# EAGLE design snc98_3x4_Switch-futuba (EAGLE 6.6.0)
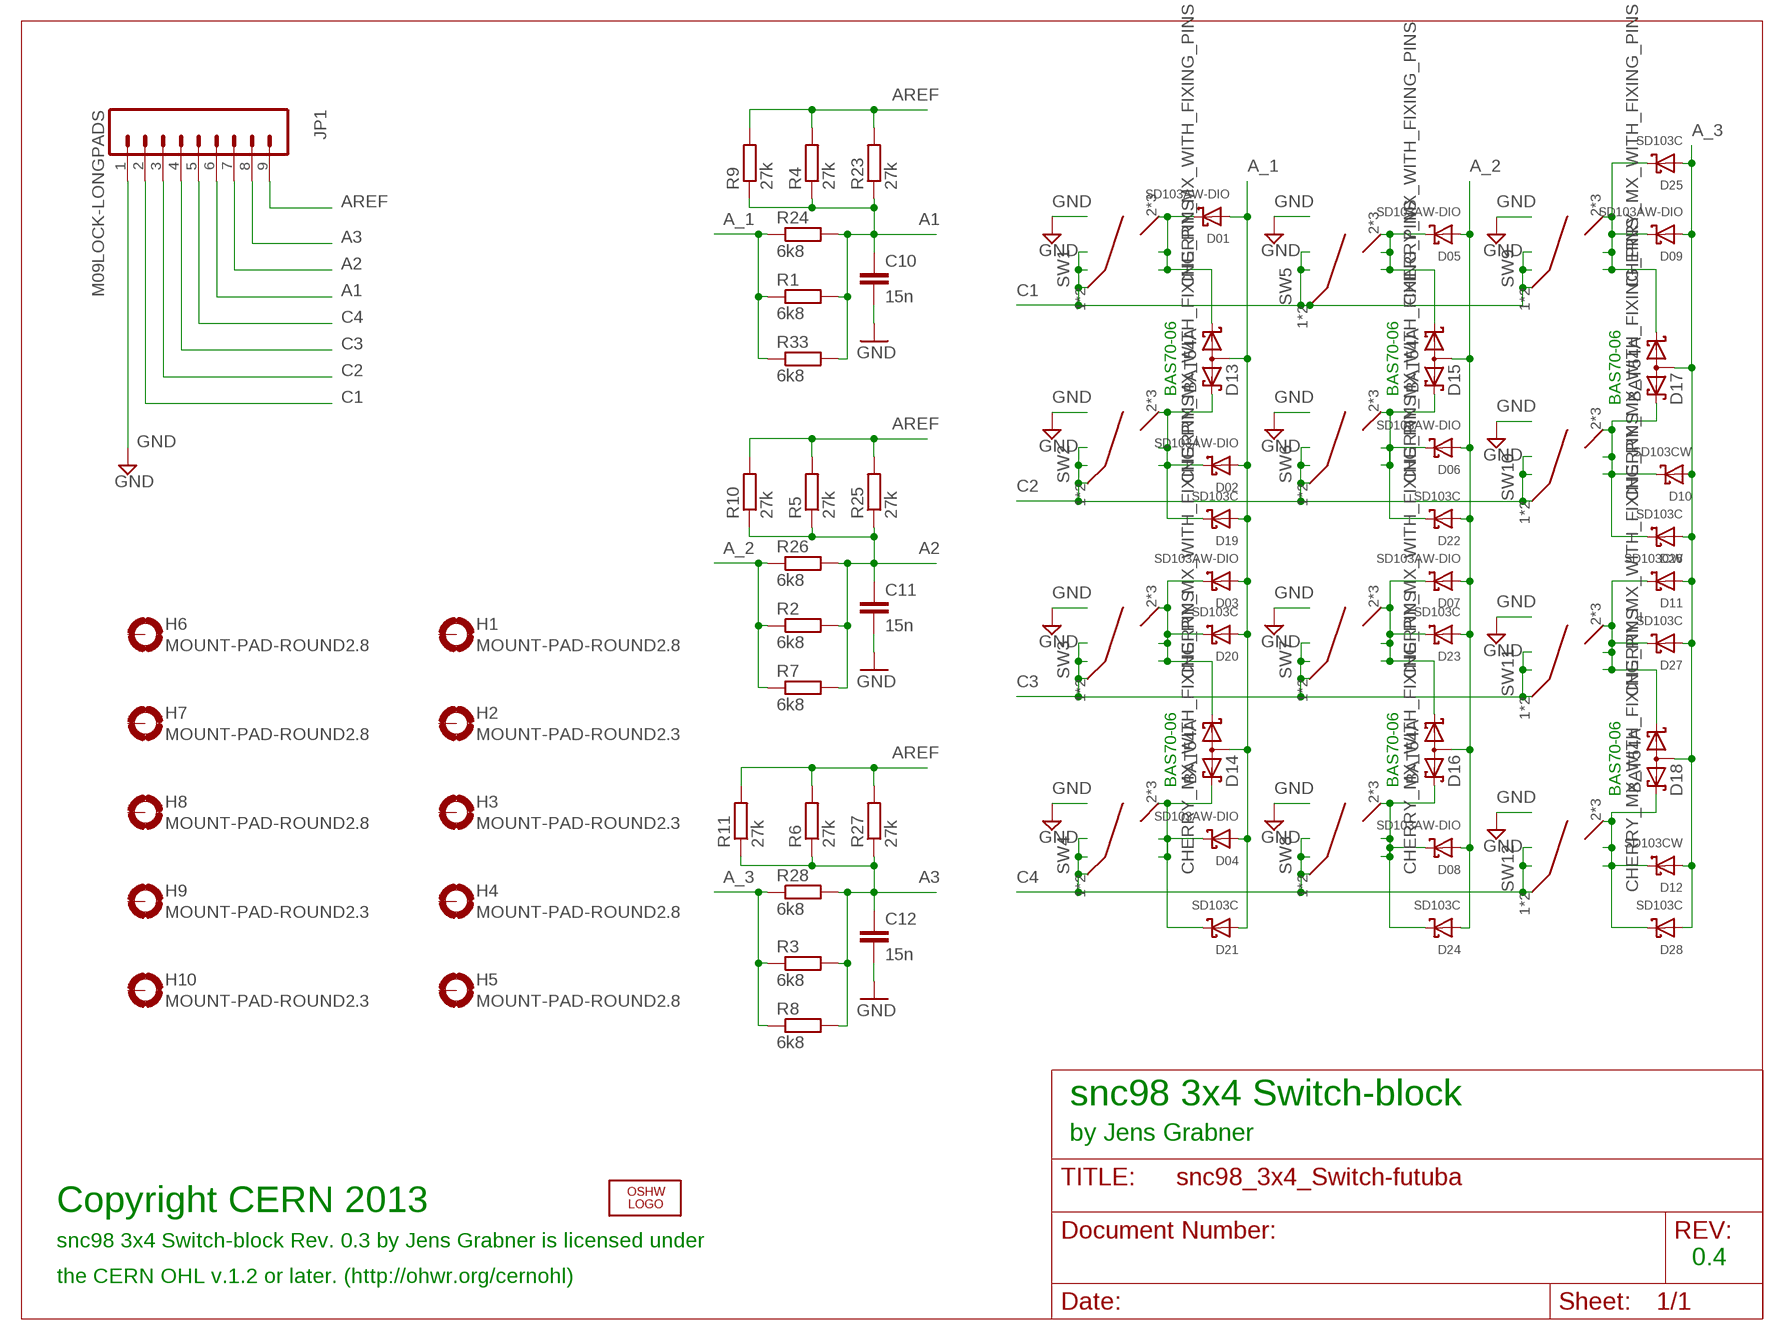
[diagram p0: schematic, sheet 1]

## Parts
C10  15n  C-EUC1206K  [C1206K]
C11  15n  C-EUC1206K  [C1206K]
C12  15n  C-EUC1206K  [C1206K]
D01  SD103AW-DIO  DIODESOD-123F  [SOD-123F]
D02  SD103AW-DIO  DIODESOD-123F  [SOD-123F]
D03  SD103AW-DIO  DIODESOD-123F  [SOD-123F]
D04  SD103AW-DIO  DIODESOD-123F  [SOD-123F]
D05  SD103AW-DIO  DIODESOD-123F  [SOD-123F]
D06  SD103AW-DIO  DIODESOD-123F  [SOD-123F]
D07  SD103AW-DIO  DIODESOD-123F  [SOD-123F]
D08  SD103AW-DIO  DIODESOD-123F  [SOD-123F]
D09  SD103AW-DIO  DIODESOD-123F  [SOD-123F]
D10  SD103CW  DIODESOD-123F  [SOD-123F]
D11  SD103CW  DIODESOD-123F  [SOD-123F]
D12  SD103CW  DIODESOD-123F  [SOD-123F]
D13  BAT54A  [SOT23]
D14  BAT54A  [SOT23]
D15  BAT54A  [SOT23]
D16  BAT54A  [SOT23]
D17  BAT54A  [SOT23]
D18  BAT54A  [SOT23]
D19  SD103C  DIODE280MIL-TH  [280MIL-TH]
D20  SD103C  DIODE280MIL-TH  [280MIL-TH]
D21  SD103C  DIODE280MIL-TH  [280MIL-TH]
D22  SD103C  DIODE280MIL-TH  [280MIL-TH]
D23  SD103C  DIODE280MIL-TH  [280MIL-TH]
D24  SD103C  DIODE280MIL-TH  [280MIL-TH]
D25  SD103C  DIODE280MIL-TH  [280MIL-TH]
D26  SD103C  DIODE280MIL-TH  [280MIL-TH]
D27  SD103C  DIODE280MIL-TH  [280MIL-TH]
D28  SD103C  DIODE280MIL-TH  [280MIL-TH]
H1  MOUNT-PAD-ROUND2.8  [2,8-PAD]
H2  MOUNT-PAD-ROUND2.3  [2,3-PAD]
H3  MOUNT-PAD-ROUND2.3  [2,3-PAD]
H4  MOUNT-PAD-ROUND2.8  [2,8-PAD]
H5  MOUNT-PAD-ROUND2.8  [2,8-PAD]
H6  MOUNT-PAD-ROUND2.8  [2,8-PAD]
H7  MOUNT-PAD-ROUND2.8  [2,8-PAD]
H8  MOUNT-PAD-ROUND2.8  [2,8-PAD]
H9  MOUNT-PAD-ROUND2.3  [2,3-PAD]
H10  MOUNT-PAD-ROUND2.3  [2,3-PAD]
JP1  M09LOCK-LONGPADS  [1X09_LOCK_LONGPADS]
LOGO1  OSHW_LOGO_8MILX0150-NT  [OSHW_8X150_NOTEXT]
R1  6k8  R-EU_R1206  [R1206]
R2  6k8  R-EU_R1206  [R1206]
R3  6k8  R-EU_R1206  [R1206]
R4  27k  R-EU_R1206  [R1206]
R5  27k  R-EU_R1206  [R1206]
R6  27k  R-EU_R1206  [R1206]
R7  6k8  R-EU_M0805  [M0805]
R8  6k8  R-EU_M0805  [M0805]
R9  27k  R-EU_M0805  [M0805]
R10  27k  R-EU_M0805  [M0805]
R11  27k  R-EU_M0805  [M0805]
R23  27k  R-EU_0204/5  [0204/5]
R24  6k8  R-EU_0204/5  [0204/5]
R25  27k  R-EU_0204/5  [0204/5]
R26  6k8  R-EU_0204/5  [0204/5]
R27  27k  R-EU_0204/5  [0204/5]
R28  6k8  R-EU_0204/5  [0204/5]
R33  6k8  R-EU_M0805  [M0805]
SW1  CHERRY_MX_WITH_FIXING_PINS  [MX1A-XXNW]
SW2  CHERRY_MX_WITH_FIXING_PINS  [MX1A-XXNW]
SW3  CHERRY_MX_WITH_FIXING_PINS  [MX1A-XXNW]
SW4  CHERRY_MX_WITH_FIXING_PINS  [MX1A-XXNW]
SW5  CHERRY_MX_WITH_FIXING_PINS  [MX1A-XXNW]
SW6  CHERRY_MX_WITH_FIXING_PINS  [MX1A-XXNW]
SW7  CHERRY_MX_WITH_FIXING_PINS  [MX1A-XXNW]
SW8  CHERRY_MX_WITH_FIXING_PINS  [MX1A-XXNW]
SW9  CHERRY_MX_WITH_FIXING_PINS  [MX1A-XXNW]
SW10  CHERRY_MX_WITH_FIXING_PINS  [MX1A-XXNW]
SW11  CHERRY_MX_WITH_FIXING_PINS  [MX1A-XXNW]
SW12  CHERRY_MX_WITH_FIXING_PINS  [MX1A-XXNW]

## Nets
A1: C10.1 JP1.6 R1.2 R4.1 R9.1 R23.1 R24.2 R33.2
A2: C11.1 JP1.7 R2.2 R5.1 R7.2 R10.1 R25.1 R26.2
A3: C12.1 JP1.8 R3.2 R6.1 R8.2 R11.1 R27.1 R28.2
A_1: D01.A D02.A D03.A D04.A D13.3(AA) D14.3(AA) D19.P$1(A) D20.P$1(A) D21.P$1(A) R1.1 R24.1 R33.1
A_2: D05.A D06.A D07.A D08.A D15.3(AA) D16.3(AA) D22.P$1(A) D23.P$1(A) D24.P$1(A) R2.1 R7.1 R26.1
A_3: D09.A D10.A D11.A D12.A D17.3(AA) D18.3(AA) D25.P$1(A) D26.P$1(A) D27.P$1(A) D28.P$1(A) R3.1 R8.1 R28.1
AREF: JP1.9 R4.2 R5.2 R6.2 R9.2 R10.2 R11.2 R23.2 R25.2 R27.2
C1: JP1.2 SW1.1 SW1.3 SW5.1 SW5.3 SW9.1 SW9.3
C2: JP1.3 SW2.1 SW2.3 SW6.1 SW6.3 SW10.1 SW10.3
C3: JP1.4 SW3.1 SW3.3 SW7.1 SW7.3 SW11.1 SW11.3
C4: JP1.5 SW4.1 SW4.3 SW8.1 SW8.3 SW12.1 SW12.3
GND: C10.2 C11.2 C12.2 JP1.1
N$2: D04.C D14.2(K2) D21.P$2(C) SW4.2 SW4.4 SW4.5
N$6: D01.C D13.1(K1) SW1.2 SW1.4 SW1.5
N$16: D09.C D17.1(K1) D25.P$2(C) SW9.2 SW9.4 SW9.5
N$18: D10.C D17.2(K2) D26.P$2(C) SW10.2 SW10.4 SW10.5
N$19: D02.C D13.2(K2) D19.P$2(C) SW2.2 SW2.4 SW2.5
N$21: D11.C D18.1(K1) D27.P$2(C) SW11.2 SW11.4 SW11.5
N$22: D12.C D18.2(K2) D28.P$2(C) SW12.2 SW12.4 SW12.5
N$24: D05.C D15.1(K1) SW5.2 SW5.4 SW5.5
N$25: D06.C D15.2(K2) D22.P$2(C) SW6.2 SW6.4 SW6.5
N$28: D07.C D16.1(K1) D23.P$2(C) SW7.2 SW7.4 SW7.5
N$30: D08.C D16.2(K2) D24.P$2(C) SW8.2 SW8.4 SW8.5
N$32: D03.C D14.1(K1) D20.P$2(C) SW3.2 SW3.4 SW3.5
Unconnected: H1.B2,8(MOUNT) H2.B2,8(MOUNT) H3.B2,8(MOUNT) H4.B2,8(MOUNT) H5.B2,8(MOUNT) H6.B2,8(MOUNT) H7.B2,8(MOUNT) H8.B2,8(MOUNT) H9.B2,8(MOUNT) H10.B2,8(MOUNT)

## Notes on the sheet
- BAS70-06 | BAS70-06
- BAS70-06
- BAS70-06 | BAS70-06
- BAS70-06
- snc98 3x4 Switch-block
- by Jens Grabner
- Copyright CERN 2013
- snc98 3x4 Switch-block Rev. 0.3 by Jens Grabner is licensed under
- 0.4
- the CERN OHL v.1.2 or later. (http://ohwr.org/cernohl)

## Library data of the parts
C10-C12 = rcl:C-EU: CAPACITOR, European symbol; OC_FARNELL: unknown; TME_EU: CC0805KRX7R9153
D01-D09 D10-D12 D19-D28 = BaseApp:DIODE; MF: MULTICOMP; MPN: SD103CW-7-F; OC_FARNELL: 2306221
D13-D18 = diode:BAT54A: Schottky Diodes Source: Fairchild .. BAT54.pdf; OC_FARNELL: unknown; TME_EU: BAT54A-DIO
H1-H10 = holes:MOUNT-PAD-ROUND: MOUNTING PAD, round; OC_FARNELL: unknown
JP1 = SparkFun-Connectors:M09: Header 9 Standard 9-pin 0.1" header. Use with straight break away headers (SKU : PRT-00116), right angle break away headers (PRT-00553), swiss pins (PRT-00743), machine pins (PRT-00117), and female headers (PRT-00115).; OC_FARNELL: unknown
LOGO1 = ohw-logo:OSHW_LOGO_8MIL; OC_FARNELL: unknown
R1-R6 R23-R28 = rcl:R-EU_: RESISTOR, European symbol; OC_FARNELL: unknown
R7 R8 R33 = rcl:R-EU_: RESISTOR, European symbol; OC_FARNELL: unknown; TME_EU: RC0805FR-076K8
R9-R11 = rcl:R-EU_: RESISTOR, European symbol; OC_FARNELL: unknown; TME_EU: RC0805FR-0727K
SW1-SW12 = Cherry_MX_v7.0:CHERRY_MX

## Net classes
0 default: clearance 0.205 mm

## Board
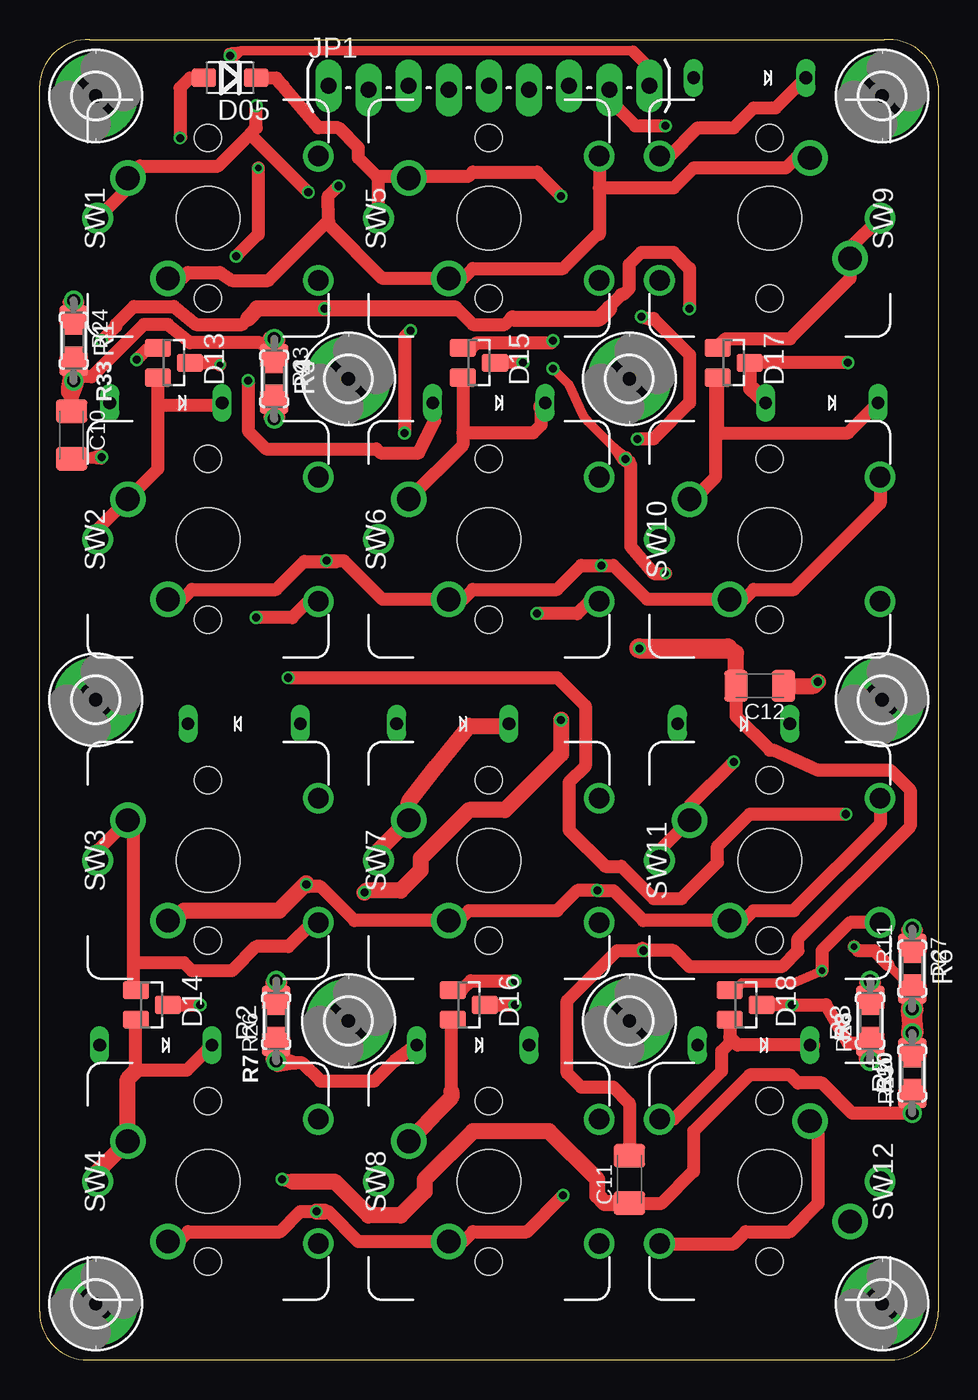
[diagram p1: board, top side]
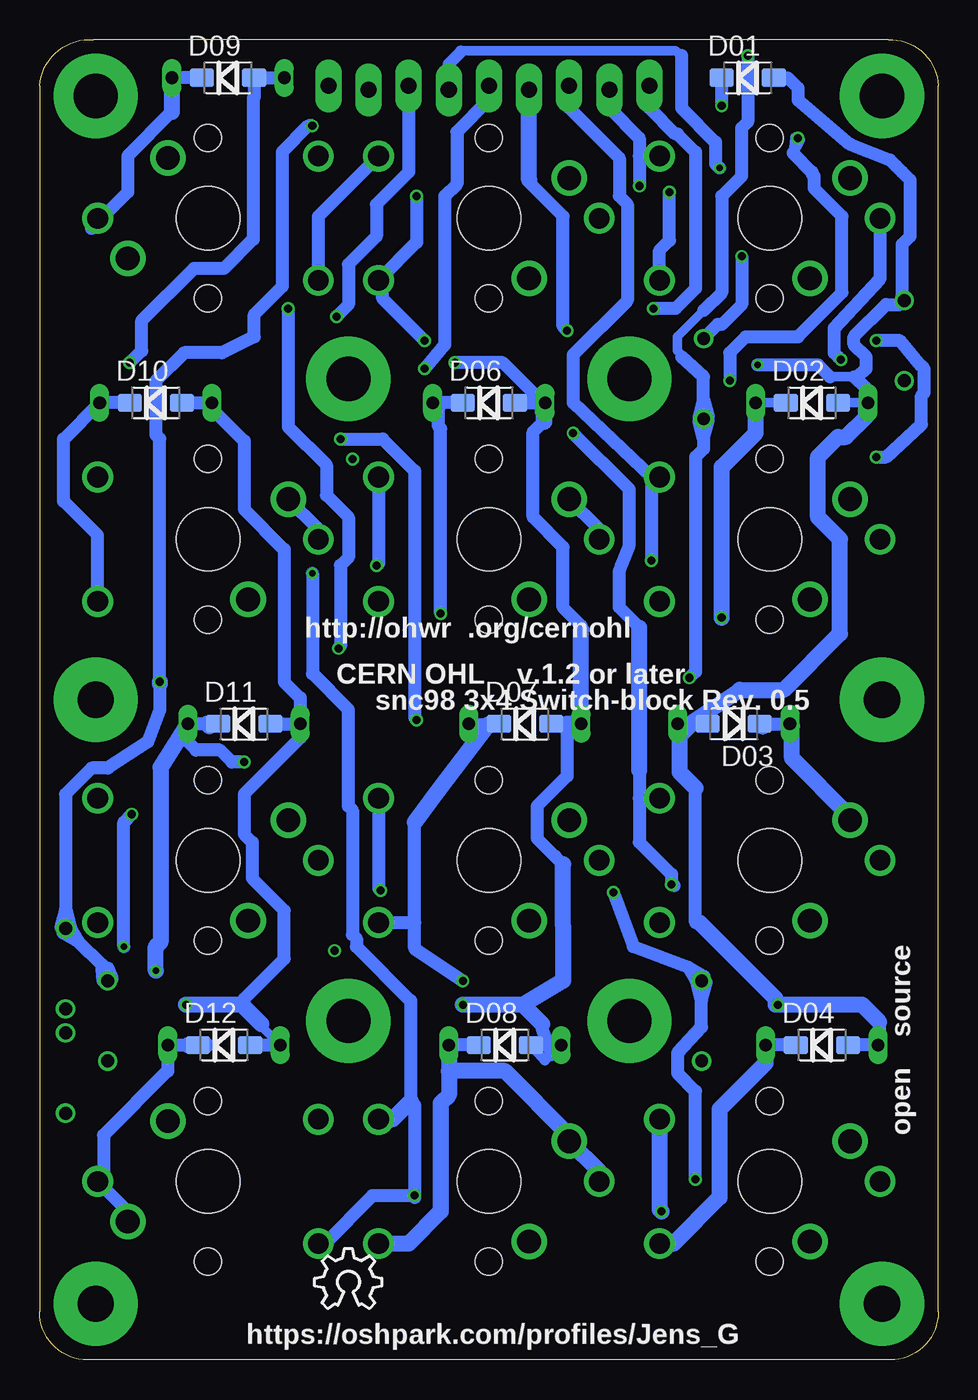
[diagram p2: board, bottom side, seen from below]

Size 56.9 x 83.58 mm. Coordinates in mm from the lower left corner, seen from the top.
Outline: 0,3.05 0,80.64 arc-90 3.17,83.57 53.47,83.57 arc-90 56.9,80.64 56.9,3.05 arc-90 53.85,0 3.05,0 arc-90 0,3.05
Copper layers (1*16): Top 0.035559375mm / dielectric 1.6mm / Bottom 0.035559375mm
Design rules "oshpark-2layer-auto-routing *": minimum track width 12mil, minimum drill 12mil, track to track 12mil, track to pad 8mil, pad to pad 8mil, via to via 8mil, smd to smd 6mil, copper to edge 15mil, drill to drill 6mil, minimum pad ring 6mil, minimum via ring 6mil, stop-mask expansion 2.5mil, vias tented up to drill 0mil, thermal gap 10mil

### Footprints (pad centres in the part's own frame; a part is rotated, then mirrored left to right if it is on the bottom)
C1206K = smd 1.5 x 2: 1 -1.5,0; 2 1.5,0
SOD-123F = smd 1.524 x 1.143: A 1.651,0; C -1.651,0
SOT23 = smd 1.143 x 1.651: 1 -0.94,-1.016; 2 0.94,-1.016; 3 0,1.016
280MIL-TH = drill 0.8 long: P$1 -3.556,0; P$2 3.556,0
2,8-PAD = drill 2.8 pad 5.334: B2,8 0,0
2,3-PAD = drill 2.3 pad 5.334: B2,8 0,0
1X09_LOCK_LONGPADS = drill 1.016 pad 1.676 long: 1 0,0.127; 2 2.54,-0.127; 3 5.08,0.127; 4 7.62,-0.127; 5 10.16,0.127; 6 12.7,-0.127; 7 15.24,0.127; 8 17.78,-0.127; 9 20.32,0.127
R1206 = smd 1.6 x 1.803: 1 -1.422,0; 2 1.422,0
M0805 = smd 1.3 x 1.6: 1 -1.016,0; 2 1.016,0
0204/5 = drill 0.813: 1 -2.54,0; 2 2.54,0
MX1A-XXNW = drill 1.5: 1 -3.81,2.54; 2 2.54,5.08 | drill 1.3: 3 3.937,-6.985; 4 -3.937,-6.985; 5 0,6.985 | hole 4: 0,0 | hole 1.7: -5.08,0; 5.08,0

### Placement (x,y rotation side)
C10  2.03,58.55 270 top
C11  37.34,11.43 90 top
C12  45.59,42.67 180 top
D01  12.06,81.15 0 bottom
D02  8,60.58 0 bottom
D03  12.95,40.26 180 bottom
D04  7.37,19.94 0 bottom
D05  12.06,81.15 180 top
D06  28.45,60.58 0 bottom
D07  26.16,40.26 0 bottom
D08  27.43,19.94 0 bottom
D09  44.96,81.15 0 bottom
D10  49.53,60.58 0 bottom
D11  43.94,40.26 0 bottom
D12  45.21,19.94 0 bottom
D13  8.51,63.12 270 top
D14  7.11,22.48 270 top
D15  27.81,63.12 270 top
D16  27.18,22.48 270 top
D17  43.94,63.12 270 top
D18  44.7,22.48 270 top
D19  8,60.58 0 top
D20  12.95,40.26 180 top
D21  7.37,19.94 0 top
D22  28.45,60.58 0 top
D23  26.16,40.26 0 top
D24  27.43,19.94 0 top
D25  44.96,81.15 0 top
D26  49.53,60.58 0 top
D27  43.94,40.26 0 top
D28  45.21,19.94 0 top
H1  3.56,80.01 0 top
H2  3.56,41.78 0 top
H3  3.56,3.56 0 top
H4  19.56,62.1 0 top
H5  19.56,21.46 0 top
H6  37.34,62.1 0 top
H7  37.34,21.46 0 top
H8  53.34,80.01 0 top
H9  53.34,41.78 0 top
H10  53.34,3.56 0 top
JP1  18.29,80.52 0 top
LOGO1  39.47,3.25 0 bottom
R1  2.16,64.52 270 top
R2  14.99,21.46 90 top
R3  52.58,21.46 90 top
R4  14.86,62.1 270 top
R5  55.24,18.16 90 top
R6  55.24,24.77 270 top
R7  14.99,21.46 90 top
R8  52.58,21.46 90 top
R9  14.86,62.1 270 top
R10  55.24,18.16 90 top
R11  55.24,24.77 270 top
R23  14.86,62.1 270 top
R24  2.16,64.52 270 top
R25  55.24,18.16 90 top
R26  14.99,21.46 90 top
R27  55.24,24.77 270 top
R28  52.58,21.46 90 top
R33  2.16,64.52 270 top
SW1  10.67,72.26 90 top
SW2  10.67,51.94 90 top
SW3  10.67,31.62 90 top
SW4  10.67,11.3 90 top
SW5  28.45,72.26 90 top
SW6  28.45,51.94 90 top
SW7  28.45,31.62 90 top
SW8  28.45,11.3 90 top
SW9  46.23,72.26 270 top
SW10  46.23,51.94 90 top
SW11  46.23,31.62 90 top
SW12  46.23,11.3 270 top

### Tracks (layer width: path | path; a pad name or v marks a point on that pad's centre or on a via)
A1  (via drill 0.41, 0.51)
  Top 0.61: 1.74,63.12 2.13,63.12 R1.2 | 1.74,63.12 1.75,61.97 R24.2 | 1.74,63.12 2.47,62.24 R24.2 | R33.2 R24.2 | R9.1 R23.1
  Top 0.813: C10.1 2.03,60.82 | 2.03,60.82 1.78,61.26 | 1.78,61.26 1.78,61.59 R24.2 | R24.2 2.16,62.79 | 2.16,62.79 R1.2 | 14.86,63.83 R4.1 14.37,63.52 | 14.86,63.83 R23.1 | 1.74,63.12 1.65,63.12 | 14.86,63.83 15.14,64.53 R23.1 | 14.86,63.83 14.58,64.53 R23.1 | 1.78,61.26 2.35,61.74 R24.2 | 1.78,61.26 1.86,62.01 R24.2 | 2.16,62.79 1.88,62.09 R24.2 | 2.16,62.79 2.44,62.09 R24.2 | 14.37,63.52 15.1,64.45 R23.1 | 14.37,63.52 14.56,64.69 R23.1 | 2.03,60.82 2.42,61.81 R24.2 | 2.03,60.82 1.85,62 R24.2 | 14.37,63.52 14.37,64.11 13.97,64.39 9.53,64.39 8.13,65.53 6.6,65.53 3.3,62.23 2.41,62.23 R24.2 | v13.84,75.44 13.84,71.25 v12.45,69.85
  Bottom 0.61: JP1.6 30.99,82.04 | 30.23,82.8 30.1,82.88 16.64,82.88 16.26,82.55
  Bottom 0.762: 30.99,82.04 30.23,82.8
  Bottom 0.813: 16.26,82.55 16.26,79.25 14.1,77.09 14.1,75.69 v13.84,75.44 | v12.45,69.85 12.45,66.8 13.72,65.53 13.97,65.53 R23.1
A2  (via drill 0.51)
  Top 0.61: R7.2 R26.2
  Top 0.813: R2.2 14.99,23.19 | 14.99,23.19 R26.2 | v38.1,66.04 38.48,65.91 38.86,65.91 41.15,63.63 41.15,60.58 38.86,58.29 v37.85,58.29 | 14.99,23.19 15.27,23.89 R26.2 | 14.99,23.19 14.7,23.89 R26.2 | v15.37,11.43 16,11.3 | R10.1 R5.1 R25.1 51.44,15.62 49.53,17.53 48.01,17.53 47.5,18.03 44.96,18.03 41.4,14.48 41.4,11.94 39.39,9.93 C11.1
  Top 1.016: v33.02,40.51 33.02,38.35 29.46,34.8 27.18,34.8 24.13,31.75 24.13,30.99 22.86,29.72 20.7,29.72 v20.57,29.59 | C11.1 35.79,9.93 35.31,10.41 35.31,11.43 32.26,14.48 27.43,14.48 24.38,11.43 24.38,10.67 22.86,9.14 20.83,9.14 18.67,11.3 16,11.3
  Bottom 0.813: v15.37,11.43 15.37,17.02 16.51,18.16 16.51,19.43 14.99,21.08 14.99,22.78 | 14.99,22.78 14.99,23.19 | 14.99,23.19 R26.2 | v37.85,58.29 35.18,58.29 33.15,56.26 33.15,40.64 v33.02,40.51 | v20.57,29.59 19.3,26.16 15.85,24.86 | 15.85,24.86 15.56,24.58 | 15.56,24.58 R26.2 | 14.99,23.19 15.27,23.89 R26.2 | 14.99,23.19 14.7,23.89 R26.2 | 15.56,24.58 14.87,24.28 R26.2 | 15.56,24.58 15.27,23.88 R26.2 | 14.99,22.78 15.28,23.93 R26.2 | 14.99,22.78 14.69,23.93 R26.2 | 15.85,24.86 14.83,24.27 R26.2 | 15.85,24.86 15.25,23.85 R26.2 | 33.53,79.5 33.53,75.18 35.56,73.15 35.56,71.12 37.34,69.34 37.34,66.8 v38.1,66.04
  Bottom 1.016: JP1.7 33.53,79.5
A3  (via drill 0.51)
  Top 0.61: R8.2 R28.2 | R11.1 R27.1
  Top 0.813: JP1.8 36.07,79.76 37.72,78.11 v39.62,78.11 | R6.1 55.24,26.49 | 55.24,26.49 R27.1 | R3.2 52.58,23.19 | 52.58,23.19 R28.2 | 55.24,26.49 55.53,27.19 R27.1 | 55.24,26.49 54.96,27.19 R27.1 | 52.58,23.19 52.86,23.89 R28.2 | 52.58,23.19 52.3,23.89 R28.2
  Top 1.016: C12.1 49.02,42.67 v49.28,42.93
  Bottom 0.813: R28.2 52.58,24.82 | 52.58,24.82 52.7,24.77 53,25.06 | 53,25.06 54.38,26.44 | 54.38,26.44 54.67,26.73 | 54.67,26.73 R27.1 | 49.28,42.8 49.28,41.15 50.04,39.12 52.58,37.47 53.59,37.47 55.24,35.81 55.24,28.52 | 55.24,28.52 55.24,28.12 | 55.24,28.12 R27.1 | 54.67,26.73 55.36,27.02 R27.1 | 54.67,26.73 54.96,27.42 R27.1 | 55.24,28.12 54.96,27.42 R27.1 | 55.24,28.12 55.53,27.42 R27.1 | 52.58,24.82 52.3,24.12 R28.2 | 52.58,24.82 52.86,24.12 R28.2 | 54.38,26.44 55.4,27.04 R27.1 | 54.38,26.44 54.98,27.46 R27.1 | 55.24,28.52 54.95,27.38 R27.1 | 55.24,28.52 55.54,27.38 R27.1 | 53,25.06 52.31,24.15 R28.2 | 53,25.06 52.88,24.01 R28.2 | v39.62,78.11 39.88,78.11 41.53,76.45 41.53,67.94 43.31,66.17 43.31,64.77 45.34,63.75 47.75,63.75 49.53,61.98 49.53,58.55 49.28,58.29 v49.28,42.93
  Bottom 1.016: v49.28,42.93 49.28,42.8
A_1  (via drill 0.41, 0.51)
  Top 0.61: R33.1 R1.1 R24.1
  Top 0.813: D14.3 v10.16,22.48 | 2.16,66.24 R1.1 2.16,66.93 2.03,67.06 2.29,67.06 | 2.16,66.24 R24.1 | 2.16,66.24 2.44,66.94 R24.1 | 2.16,66.24 1.88,66.94 R24.1 | D13.3 11.3,63.12 v11.43,62.99
  Bottom 0.33: 15.49,40.26 15.75,40.13
  Bottom 0.61: D04.A 5.33,19.94 4.7,19.94 | D02.A D19.P$1 | 6.86,62.23 5.33,62.23
  Bottom 0.813: v10.16,22.48 10.29,22.48 | 15.37,36.2 15.37,27.69 15.11,27.69 | D03.A 15.49,40.26 D20.P$1 | 3.75,21.4 3.75,20 D21.P$1 5.33,19.94 | v11.43,62.99 7.62,62.99 6.86,62.23 | D19.P$1 4.57,60.71 4.57,61.47 5.33,62.23 5.08,62.23 4.57,62.74 4.57,63.5 5.33,64.26 5.33,64.77 3.3,66.8 2.54,66.8 | 2.54,66.8 2.41,66.8 R24.1 2.29,67.18 2.29,70.61 1.78,71.12 1.78,74.68 2.29,75.18 2.67,75.56 3.05,75.95 5.59,76.96 8.89,79.76 8.89,80.52 9.53,81.15 D01.A | 2.54,66.8 2.29,67.06
  Bottom 1.016: 3.75,21.4 4.83,22.48 v10.16,22.48 | 15.37,36.2 16.38,37.21 16.38,39.5 15.75,40.13 15.75,40.26 12.57,42.42 9.78,42.42 6.22,45.97 6.22,51.94 7.62,53.34 7.62,57.15 6.35,58.42 5.84,58.42 4.57,59.69 4.57,60.45 D19.P$1 | 10.29,22.48 10.29,22.86 15.11,27.69
A_2  (via drill 0.51)
  Top 0.61: R7.1 R26.1
  Top 0.813: D16.3 v30.1,22.48 | 8.95,77.41 v8.89,77.34 8.89,80.52 9.53,81.15 D05.A | v13.21,61.98 13.21,58.8 14.35,57.66 21.34,57.66 21.59,57.4 24,57.4 25.02,59.44 25.02,60.45 D22.P$1 | v30.61,63.12 D15.3 | R26.1 14.99,19.74 | 14.99,19.74 R2.1 | D24.P$1 22.48,18.92 21.21,17.65 17.78,17.65 16.64,18.8 16.2,18.8 | 16.2,18.8 15.8,18.92 | 15.8,18.92 R26.1 | 14.99,19.74 14.7,19.04 R26.1 | 14.99,19.74 15.27,19.04 R26.1 | 15.8,18.92 15.1,19.21 R26.1 | 15.8,18.92 15.1,18.64 R26.1 | 16.2,18.8 15.06,19.22 R26.1 | 16.2,18.8 15.06,18.63 R26.1
  Bottom 0.33: 22.61,40.39 D23.P$1 22.99,40.51 23.37,40.26
  Bottom 0.61: v8.89,77.34 8.89,77.15 9.19,76.39 | 9.19,76.39 9.09,77.37 v8.89,77.34 | 9.19,76.39 8.73,77.22 v8.89,77.34 | v8.89,77.34 9.09,77.39 9.06,76.67 8.73,77.22 v8.89,77.34 | D07.A 23.81,40.26 | D08.A 24.89,18.92 24.48,19.34
  Bottom 0.813: 9.19,76.39 8,75.18 8,75.06 7.87,74.93 7.87,74.17 6.1,72.39 6.1,67.56 8.89,64.77 12.19,64.77 13.21,63.75 v13.21,61.98 | 25.08,21.27 25.08,20.95 24.48,19.34 | 23.5,40.26 23.75,40.26 | 23.75,40.26 23.5,40.01 23.5,36.96 25.4,35.05 25.4,33.02 24.26,31.88 23.88,31.5 23.75,31.37 | 23.75,40.26 23.81,40.26 | v30.61,63.12 27.56,63.12 25.02,60.58 25.02,60.45 | 22.73,40.26 22.61,40.39 | 22.61,46.23 22.61,46.48 23.75,47.62 23.75,51.44 25.65,53.34 25.65,58.74 24.96,59.44 | D06.A D22.P$1 | D24.P$1 D08.A
  Bottom 1.016: 25.08,21.27 26.29,22.48 | 26.29,22.48 v30.1,22.48 | 23.5,40.26 23.37,40.26 | 22.61,40.39 22.61,46.23 | 24.96,59.37 24.96,59.44 24.96,59.88 25.02,59.94 25.02,60.45 D22.P$1 | 26.29,22.48 23.75,24 23.75,27.43 23.75,31.37
A_3  (via drill 0.51)
  Top 0.61: R8.1 R28.1
  Top 0.813: D18.3 v47.62,22.48 49.78,22.48 51.18,20.07 52.15,20.07 | v51.18,63.12 D17.3 44.96,61.59 45.15,61.4 | 52.58,19.74 R3.1 52.55,20.07 52.15,20.07 | 52.58,19.74 R28.1 | 52.58,19.74 52.3,19.04 R28.1 | 52.58,19.74 52.86,19.04 R28.1 | 52.15,20.07 52.27,18.89 R28.1 | 52.15,20.07 52.83,19.1 R28.1
  Top 1.016: 45.04,61.51 45.15,61.4 D26.P$1
  Bottom 0.61: 42.86,21.27 42.86,21.14 D28.P$1 | D11.A 41.53,40.26
  Bottom 0.813: v51.18,63.12 50.42,63.88 50.42,65.79 47.12,69.09 45.21,69.09 43.37,70.93 43.37,79.88 43.31,79.95 D09.A D25.P$1 | D10.A D26.P$1 45.97,60.2 43.94,58.17 43.94,53.85 41.4,51.31 41.4,42.93 40.39,41.91 D27.P$1 40.51,40.26 | D12.A D28.P$1 | 41.53,40.26 40.51,40.26 | 40.51,40.26 40.39,40.13 40.39,39.37 43.94,35.81 43.94,33.27 43.43,32.77 43.43,30.48 41.4,28.45 41.4,25.4 43.94,22.86 43.94,22.35
  Bottom 1.016: 42.86,21.27 43.94,22.35 44.07,22.48 v47.62,22.48
AREF  (via drill 0.41, 0.51)
  Top 0.61: 12.9,82.88 37.57,82.88 37.59,82.8 | 12.9,82.88 12.78,82.88 12.32,82.42 12.22,82.42 v12.06,82.55 11.97,82.73 | R6.2 55.24,23.44 | 55.24,23.44 55.24,23.5 53.72,25.02 | 55.24,23.44 54.86,22.36 R27.2 | 55.24,23.44 55.63,22.36 R27.2 | R9.2 R23.2 | R10.2 R25.2 | R11.2 R27.2 | 12.9,82.88 12.19,82.8
  Top 0.762: 38.73,81.66 37.59,82.8
  Top 0.813: R4.2 14.86,60.38 | 14.86,60.38 R23.2 | 38.73,81.66 38.73,80.77 JP1.9 | R25.2 55.24,21.01 | 55.24,21.01 55.24,21.41 | 55.24,21.41 55.24,21.51 | 55.24,21.51 55.24,21.92 | 55.24,21.92 R27.2 | R6.2 55.24,23.04 | 55.24,23.04 R27.2 | R5.2 55.24,19.89 | 55.24,19.89 R25.2 | v15.75,43.18 32.77,43.18 34.54,41.4 34.54,37.59 33.53,36.58 33.53,33.53 35.81,31.24 36.83,31.24 38.86,29.21 40.64,29.21 42.93,31.5 42.93,32.51 44.96,34.54 v51.05,34.54 | 14.86,60.38 14.58,59.68 R23.2 | 14.86,60.38 15.14,59.68 R23.2 | 55.24,21.51 55.05,21.02 | 55.05,21.02 54.96,20.82 R25.2 | 55.24,21.51 55.53,20.82 R25.2 | 55.24,19.89 55.53,20.59 R25.2 | 55.24,19.89 54.96,20.59 R25.2 | 55.24,21.41 55.53,22.11 R27.2 | 55.24,21.41 55.05,21.9 | 55.05,21.9 54.96,22.11 R27.2 | 55.24,23.04 54.96,22.34 R27.2 | 55.24,23.04 55.53,22.34 R27.2 | 55.24,21.92 54.95,20.78 R25.2 | 55.24,21.92 55.54,20.78 R25.2 | R25.2 54.97,20.82 55.44,21.9 55.55,20.73 R25.2 | 55.05,21.9 54.94,20.73 R25.2 | 55.05,21.9 55.52,20.82 R25.2 | 55.24,21.01 55.54,22.15 R27.2 | 55.24,21.01 54.95,22.15 R27.2 | 55.05,21.02 55.52,22.1 R27.2 | 55.05,21.02 54.94,22.2 R27.2 | R27.2 55.55,22.2 55.44,21.02 54.97,22.1 R27.2 | 53.72,25.02 52.83,25.91 51.82,25.91 v51.56,26.16
  Bottom 0.61: 16.26,63.5 16.26,63.63 16.51,63.88 16.51,64.77 14.86,66.42 13.84,67.44
  Bottom 0.813: R23.2 14.86,60.38 | 14.86,60.38 14.86,60.78 | 14.86,60.78 14.86,62.23 16.26,63.5 | v12.06,82.55 12.06,78.36 12.45,77.98 12.45,74.93 13.72,73.66 13.72,67.56 14.86,66.42 | R23.2 14.86,58.75 | 14.86,58.75 14.86,58.34 | 14.86,58.34 14.86,57.66 15.37,57.15 15.37,43.56 v15.75,43.18 | 14.86,60.38 14.58,59.68 R23.2 | 14.86,60.38 15.14,59.68 R23.2 | 14.86,58.75 15.14,59.45 R23.2 | 14.86,58.75 14.58,59.45 R23.2 | 14.86,60.78 14.56,59.64 R23.2 | 14.86,60.78 15.15,59.64 R23.2 | 14.86,58.34 15.15,59.49 R23.2 | 14.86,58.34 14.56,59.49 R23.2 | v51.56,26.16 51.56,34.04 v51.05,34.54
C1  (via drill 0.51)
  Top 0.813: SW1.1 9.02,68.45 9.4,68.83 11.43,68.83 12.19,68.33 14.48,68.33 18.29,72.14 | 18.29,72.14 18.27,73.66 v18.92,74.31 | 18.29,72.14 18.29,71.88 21.72,68.45 SW5.1 26.8,68.45 27.43,69.09 33.15,69.09 35.43,71.37 | SW5.3 35.43,74.17 | 35.43,74.17 35.43,71.37 | 35.43,71.37 35.43,71.25 | SW9.1 47.88,76.07 47.24,75.44 41.4,75.44 40.13,74.17 35.43,74.17
  Bottom 0.813: 20.83,79.25 18.92,77.34 18.92,76.2 | 18.92,76.2 v18.92,74.31 | SW1.3 18.92,76.2 | SW9.3 39.24,72.39 SW5.3
  Bottom 1.016: JP1.2 20.83,79.25
C2  (via drill 0.51)
  Top 0.813: SW2.1 9.02,48.13 9.65,48.77 14.99,48.77 16.76,50.55 18.87,50.55 v18.16,50.6 19.25,50.6 21.72,48.13 SW6.1 26.8,48.13 27.43,48.77 32.77,48.77 34.29,50.29 v35.56,50.29 36.32,50.29 38.48,48.13 SW10.1 44.58,48.13 45.21,48.77 47.75,48.77 53.21,54.23 SW10.3
  Bottom 0.813: JP1.3 23.37,79.25 20.19,76.07 20.19,73.66 19.68,73.15 19.68,67.06 23.11,63.63 23.11,60.58 18.16,55.88 | 18.16,55.88 v18.16,50.6 | 18.16,55.88 SW2.3 | SW6.3 35.43,50.42 v35.56,50.29
C3  (via drill 0.51)
  Top 0.813: v23.5,65.15 23.11,64.77 v23.11,58.67 | SW11.3 53.21,33.91 47.75,28.45 45.21,28.45 44.58,27.81 SW11.1 38.23,27.81 36.32,29.72 v35.31,29.72 34.04,29.72 32.77,28.45 27.18,28.45 26.54,27.81 SW7.1 19.94,27.81 17.78,29.97 17.02,29.97 v16.89,30.1 16.67,29.88 16.6,29.88
  Top 1.016: SW3.1 8.51,27.81 9.14,28.45 15.17,28.45 16.6,29.88 16.89,30.17
  Bottom 0.813: 18.92,46.35 20.19,47.62 20.19,49.91 20.07,50.29 19.56,51.56 19.56,55.12 v23.11,58.67 | v23.5,65.15 23.75,65.41 23.75,72.39 25.91,74.55 25.91,74.68 | 18.92,37.34 18.92,35.56 | 18.92,35.56 18.92,32.77 16.89,30.73 16.89,30.17 16.86,30.13 | 18.29,35.56 18.92,35.56 | v16.89,30.1 16.86,30.13 | 16.86,30.13 16.73,30.01 | SW7.3 35.43,29.84 v35.31,29.72
  Bottom 1.016: 18.92,37.34 18.92,46.35 | 25.91,74.68 JP1.4 | SW3.3 18.29,35.56
C4  (via drill 0.41, 0.51)
  Top 0.61: 36.37,57.74 34.67,59.44 34.42,59.82 33.53,61.72 v32.51,62.74 | 36.37,57.74 37.05,56.8 | 37.05,56.8 v37.08,57.02 | 37.05,56.8 37.41,56.67 v37.08,57.02 | 37.05,56.8 37.18,57.2 v37.08,57.02 | 36.37,57.74 36.91,56.91 v37.08,57.02 | 36.37,57.74 37.45,56.94 v37.08,57.02
  Top 0.813: 37.41,56.67 37.41,51.48 38.86,49.78 v39.62,49.78 | SW4.1 8.76,7.49 9.4,8.13 15.24,8.13 16.51,9.4 v17.53,9.4 | 18.03,9.4 18.29,9.4 20.19,7.49 SW8.1 26.8,7.49 27.43,8.13 30.86,8.13 v33.15,10.41 | SW12.3 43.94,7.37 44.7,8.13 47.5,8.13 49.28,9.91 49.28,14.48 48.77,14.99 SW12.1
  Top 1.016: v17.53,9.4 18.03,9.4
  Bottom 0.813: JP1.5 28.45,79.76 30.48,77.72 30.48,74.42 31.24,73.66 31.24,64.26 v32.51,62.74 | v33.15,10.41 33.15,16.13 33.4,16.38 33.4,22.73 36.83,26.16 36.83,26.67 37.08,26.92 37.08,34.8 37.34,35.05 37.34,41.15 39.62,43.43 v39.62,49.78 | v33.15,10.41 33.15,10.29 | SW12.3 38.86,7.37 35.81,10.41 v33.15,10.41
  Bottom 1.016: SW4.3 17.65,9.53 v17.53,9.4 | SW8.3 34.54,15.24 33.4,16.38
GND  (via drill 0.51)
  Top 0.61: C10.2 2.93,57.05 | 2.93,57.05 3.18,57.05 | 3.18,57.05 3.83,57.05 v3.94,57.15 | 3.18,57.05 3.91,56.95 v3.94,57.15 | 3.18,57.05 3.86,57.34 v3.94,57.15 | 2.93,57.05 3.92,56.95 v3.94,57.15 | 2.93,57.05 3.88,57.34 v3.94,57.15
  Top 0.813: 38.35,25.91 38.23,26.04 38.1,26.04 v38.23,25.91 | v3.94,64.52 4.83,65.41 4.83,65.53 5.97,66.67 8.51,66.67 9.91,65.53 12.83,65.53 13.21,65.91 | 36.07,66.55 36.07,66.67 36.83,67.44 36.96,67.44 37.34,67.82 37.34,69.34 38.1,70.1 40.13,70.1 41.15,69.09 v41.15,66.55 | v38.23,25.91 36.58,25.91 33.4,22.73 33.4,18.16 34.29,17.27 36.32,17.27 37.34,16.26 C11.2 | 26.29,66.55 26.42,66.55 27.43,65.53 29.46,65.53 29.84,65.91 29.97,65.91 | C12.2 44.09,40.74 46.23,38.61 46.48,38.61 49.28,37.34 53.85,37.34 55.12,36.07 55.12,33.78 48.01,26.67 48.01,25.91 46.99,24.89 41.15,24.89 40.13,25.91 v38.23,25.91
  Top 1.016: 36.07,66.55 35.43,65.91 29.97,65.91 | 13.21,65.91 13.76,66.46 13.76,66.55 v18.03,66.55 26.29,66.55 | C12.2 44.09,44.77 43.56,45.04
  Top 1.27: v37.97,45.04 43.56,45.04
  Bottom 0.813: v41.15,66.55 41.15,59.05 38.73,56.64 38.73,54.74 37.34,53.34 37.34,50.8 37.85,50.29 37.85,45.17 v37.97,45.04 | 18.29,79.88 18.29,79.25 16.64,77.6 16.51,77.6 15.37,76.45 15.37,67.82 16.64,66.55 v18.03,66.55 | v3.94,57.15 3.3,57.15 1.07,59.21 1.07,61.04 0.89,61.21 0.89,62.74 1.07,62.92 2.41,64.52 v3.94,64.52
  Bottom 1.016: JP1.1 18.29,79.88
N$2
  Top 0.813: D14.2 6.1,18.41 6.16,18.35 9.34,18.35 D21.P$2
  Top 1.016: SW4.5 3.68,11.94 SW4.2 5.59,17.78 6.16,18.35 | 10.79,19.81 D21.P$2
  Bottom 0.61: 9.14,19.81 8.89,19.81 D04.C | 8.76,19.81 8.88,19.81
  Bottom 0.813: 10.92,19.75 D21.P$2 D04.C 8.88,19.81
  Bottom 1.016: 10.92,19.75 10.92,18.8 13.84,15.88 13.84,10.29 16.76,7.37 SW4.4
N$6  (via drill 0.51)
  Top 0.61: v6.16,63.31 6.1,63.25
  Top 0.813: v6.16,63.31 6.86,64.01 7.44,64.01 D13.1 | SW1.5 5.59,74.17 SW1.2 6.35,75.56 11.3,75.56 13.34,77.6 | 13.34,77.6 13.72,77.98 v13.72,79.38 | v17.02,73.91 13.34,77.6
  Bottom 0.813: SW1.5 3.68,68.45 6.6,65.28 6.6,63.75 v6.16,63.31 6.35,63.5 | v13.72,79.38 D01.C | SW1.4 17.65,70.23 17.02,70.87 v17.02,73.91
N$16
  Top 0.813: D17.1 42.93,64.14 43.43,64.64 47.5,64.64 51.31,68.45 SW9.2 51.31,70.36 SW9.5 | SW9.4 39.88,76.2 41.66,77.98 43.94,77.98 45.21,79.25 46.61,79.25 D25.P$2
  Bottom 0.813: D09.C D25.P$2 | 48.51,78.99 51.31,76.2 51.31,73.91 53.59,71.63 53.59,71.88 SW9.5
  Bottom 1.016: D25.P$2 48.51,78.99
N$18
  Top 0.813: D17.2 42.93,62 | 42.93,62 42.8,61.87 42.8,55.89 41.41,54.48 SW10.2 | 42.93,62 42.93,58.67 51.18,58.67 D26.P$2
  Bottom 0.813: D10.C D26.P$2 55.37,58.29 55.37,54.36 53.21,52.2 SW10.4 | SW10.5 39.24,52.58 SW10.2
N$19  (via drill 0.51)
  Top 0.813: 7.49,60.45 7.49,56.39 SW2.2 3.68,52.58 SW2.5 | D13.2 7.49,60.45 | 7.49,60.45 11.43,60.45 D19.P$2 | SW2.4 17.02,48.01 16,46.99 v13.72,46.99
  Bottom 0.33: D19.P$2 11.56,60.39
  Bottom 0.61: D02.C D19.P$2
  Bottom 1.016: 11.56,60.39 11.56,58.67 13.72,56.52 v13.72,46.99
N$21  (via drill 0.41, 0.51)
  Top 0.61: 43.99,23.42 44.45,23.88 47.75,23.88 v49.53,24.64
  Top 0.813: SW11.4 51.31,27.69 49.53,25.91 v49.53,24.64 | SW11.5 39.24,32.26 SW11.2 41.15,35.05 v43.94,37.85
  Top 1.016: D18.1 43.99,23.42
  Bottom 0.61: D11.C 45.97,40.26 46.13,40.1
  Bottom 0.813: 46.29,40.26 D27.P$2 47.5,39.12 46.99,38.61 45.47,38.61 44.7,37.85 v43.94,37.85
  Bottom 1.016: D27.P$2 49.24,37.51 49.24,26.46 49.53,26.16 v49.53,24.64 | 46.29,40.26 46.13,40.1
N$22
  Top 0.813: 48.58,19.94 44.2,19.94 43.88,20.26 | D18.2 43.69,20.45 43.88,20.26 | SW12.4 40.13,15.24 43.18,18.29 43.18,19.56 43.88,20.26
  Top 1.27: D28.P$2 48.58,19.94
  Bottom 0.33: 47.75,19.94 47.5,19.94
  Bottom 0.813: D12.C D28.P$2 48.77,18.29 52.83,14.22 52.83,11.68 SW12.5 51.31,9.4 SW12.2
  Bottom 1.016: 47.5,19.94 D12.C 46.35,19.94
N$24  (via drill 0.51)
  Top 0.813: 21.35,74.92 21.34,74.93 | 21.34,74.93 20.19,76.07 20.19,76.71 18.92,77.98 17.65,77.98 15.42,80.63 | 15.42,80.63 14.99,81.15 | D05.C 14.9,81.15 15.42,80.63 | 21.35,74.92 23.25,74.92 SW5.2 | D15.1 27.36,64.06 27.69,64.39 32.38,64.39 v32.51,64.52 | SW5.5 21.46,74.8 21.35,74.92 | 21.34,74.93 27.18,74.93 27.43,75.18 31.5,75.18 v33.02,73.66
  Bottom 0.813: v32.51,64.52 35.18,67.18 35.18,68.07 SW5.4 33.02,70.74 v33.02,73.66
N$25  (via drill 0.51)
  Top 0.813: D15.2 26.8,58.67 | 26.8,58.67 26.8,57.91 SW6.2 | 31.75,60.33 31.75,59.18 31.24,58.67 26.8,58.67 | SW6.4 34.8,48.01 34.04,47.24 v31.5,47.24
  Top 1.016: 31.75,60.33 D22.P$2
  Bottom 0.813: D06.C D22.P$2 31.62,60.2 31.62,59.05 31.5,58.93 v31.5,47.24 | SW6.5 21.46,52.58 SW6.2
N$28  (via drill 0.51)
  Top 0.813: v30.1,24 27.3,24 26.72,23.42 D16.1
  Top 1.016: D23.P$2 29.53,40.26 29.4,40.13 27.18,40.13 25.15,37.59 23.37,35.31 SW7.2 21.46,32.26 SW7.5
  Bottom 0.33: D23.P$2 29.46,40.2
  Bottom 0.61: D07.C D23.P$2
  Bottom 0.813: 28.51,40.2 29.46,40.2 | 33.15,27.69 33.15,26.04 v30.1,24 | 33.15,27.69 33.15,34.04 | SW7.4 33.15,27.69
  Bottom 1.016: 28.51,40.2 31.62,36.07 33.15,34.04
N$30
  Top 0.813: 26.08,16.98 26.08,21.45 D16.2
  Top 1.016: 26.08,16.98 26.08,16.63 25.2,15.75 24.26,14.73 SW8.2
  Bottom 0.61: 30.99,19.18 30.99,19.3
  Bottom 0.813: D24.P$2 31.11,19.81 31.11,19.43 31.05,19.37 31.05,20 30.99,20.07 30.73,20.07 | 30.99,19.3 D24.P$2 | 29.46,19.94 D24.P$2
  Bottom 1.016: 29.46,19.94 D08.C | 30.99,19.18 30.99,18.29 | 30.99,18.29 30.99,16.76 31.5,16.26 31.5,9.4 33.53,7.37 SW8.4 | SW8.5 21.46,11.94 SW8.2 23.37,14.22 27.43,18.29 30.99,18.29
N$32
  Top 0.813: 5.97,25.4 5.97,23.47 6.02,23.42 D14.1 | 5.97,25.4 5.97,33.78 SW3.2 3.68,32.26 SW3.5 | SW3.4 17.27,27.69 15.75,26.16 13.72,26.16 12.19,24.64 9.65,24.64 9.14,25.15 6.22,25.15 5.97,25.4
  Bottom 0.61: 11.42,40.25 11.18,40.01
  Bottom 0.813: D20.P$2 10.79,40.26 11.05,40.01 11.18,40.01 | D03.C 11.42,40.26 11.42,40.25
  Bottom 1.016: D20.P$2 9.27,40.13 9.27,38.1 5.59,34.42 SW3.2

### Text on the board
bPlace: http://ohwr .org/cernohl | CERN OHL v.1.2 or later | snc98 3x4 Switch-block Rev. 0.5 | source | open | https://oshpark.com/profiles/Jens_G